# EAGLE design base-2u-mains-filter (EAGLE 5.06)
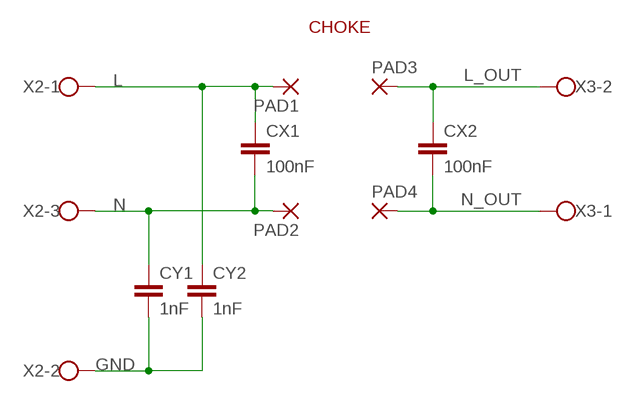
[diagram p0: schematic, sheet 1]

## Parts
CX1  100nF  CXXC15B6  [XC15B6]
CX2  100nF  CXXC15B6  [XC15B6]
CY1  1nF  CYYC10B5  [YC10B5]
CY2  1nF  CYYC10B5  [YC10B5]
PAD1  3,17/1,1  [3,17/1,1]
PAD2  3,17/1,1  [3,17/1,1]
PAD3  3,17/1,1  [3,17/1,1]
PAD4  3,17/1,1  [3,17/1,1]
X2  W237-03P  [W237-133]
X3  W237-02P  [W237-132]

## Nets
GND: CY1.2 CY2.2 X2.2
L: CX1.1 CY2.1 PAD1.1(P) X2.1
L_OUT: CX2.1 PAD3.1(P) X3.2
N: CX1.2 CY1.1 PAD2.1(P) X2.3
N_OUT: CX2.2 PAD4.1(P) X3.1

## Notes on the sheet
- CHOKE

## Library data of the parts
CX1 CX2 = rcl:CX: X CAPACITOR for power line
CY1 CY2 = rcl:CY: Y CAPACITOR for power line
PAD1-PAD4 = wirepad:3,17/1,1: THROUGH-HOLE PAD
X2 = con-wago-508:W237-03P: WAGO SREW CLAMP
X3 = con-wago-508:W237-02P: WAGO SREW CLAMP

## Board
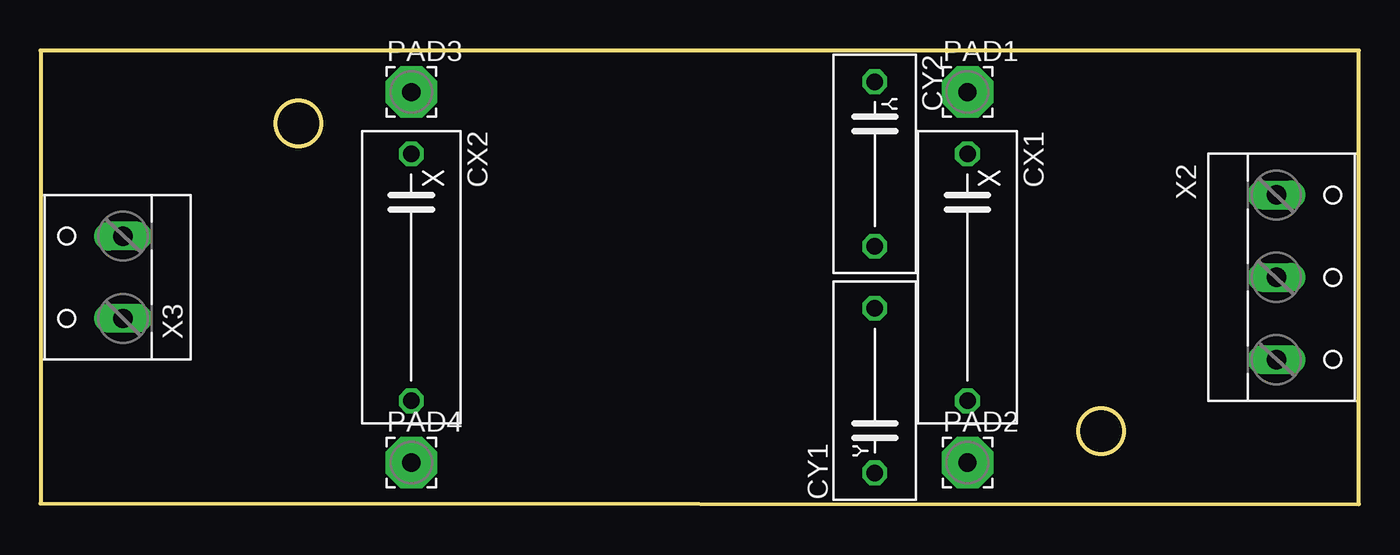
[diagram p1: board, top side]
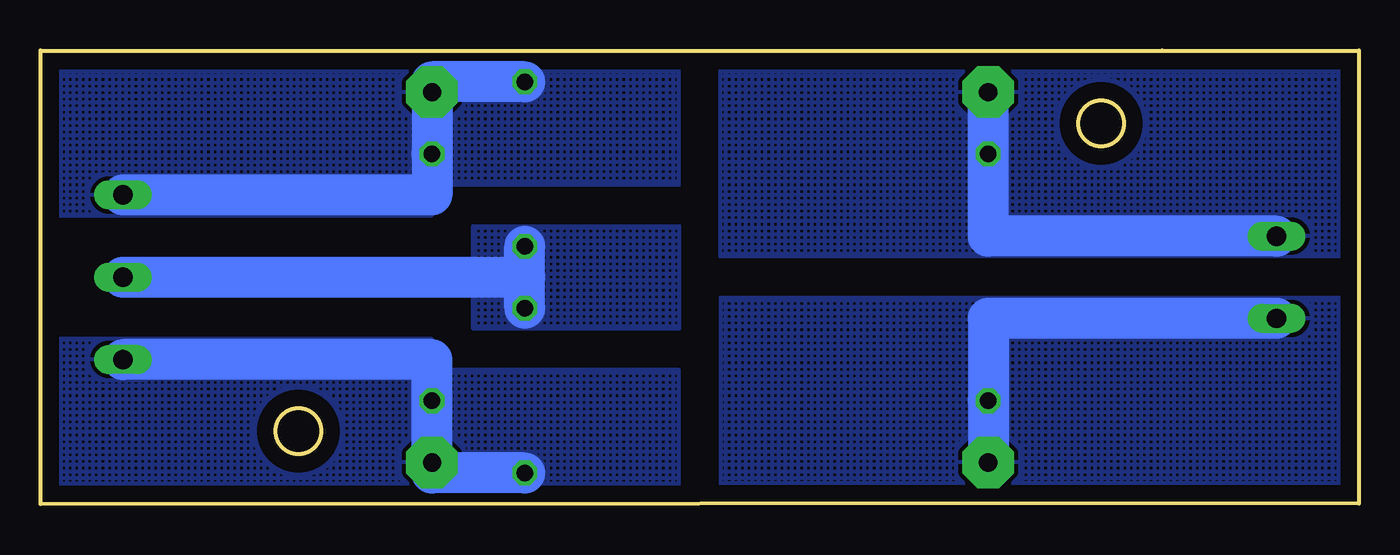
[diagram p2: board, bottom side, seen from below]

Size 81.28 x 27.98 mm. Coordinates in mm from the lower left corner, seen from the top.
Outline: 81.28,27.98 12.14,27.98 0,27.98 0,0.04 81.28,0 81.28,27.98
Outline: circle at 15.89,23.49 radius 1.4
Outline: circle at 65.39,4.49 radius 1.4
Copper layers (1*16): Top 0.035mm / dielectric 1.5mm / Bottom 0.035mm
Design rules "default": minimum track width 10mil, minimum drill 24mil, track to track 8mil, track to pad 8mil, pad to pad 8mil, via to via 8mil, smd to smd 8mil, copper to edge 40mil, drill to drill 8mil, minimum pad ring 10mil, minimum via ring 8mil, stop-mask expansion 4mil, vias tented up to drill 0mil, thermal gap 10mil

### Footprints (pad centres in the part's own frame; a part is rotated, then mirrored left to right if it is on the bottom)
XC15B6 = drill 1.016 octagon: 1 -7.62,0; 2 7.62,0
YC10B5 = drill 1.016 octagon: 1 -5.08,0; 2 5.08,0
3,17/1,1 = drill 1.118 pad 3.175 octagon: 1 0,0
W237-133 = drill 1.194 long: 1 -5.08,-0.635; 2 0,-0.635; 3 5.08,-0.635
W237-132 = drill 1.194 long: 1 -2.54,-0.635; 2 2.54,-0.635

### Placement (x,y rotation side)
CX1  57.15,13.99 270 top
CX2  22.86,13.99 270 top
CY1  51.44,7.01 90 top
CY2  51.44,20.98 270 top
PAD1  57.15,25.42 0 top
PAD2  57.15,2.56 0 top
PAD3  22.86,25.42 0 top
PAD4  22.86,2.56 0 top
X2  76.83,13.99 270 top
X3  4.45,13.99 90 top

### Tracks (layer width: path | path; a pad name or v marks a point on that pad's centre or on a via)
GND
  Bottom 2.54: 51.44,13.99 X2.2 | 51.44,13.99 CY2.2 | CY1.2 51.44,13.99
  pour Bottom (hatched): 54.61,17.16 41.91,17.16 41.91,10.81 54.61,10.81
L
  Bottom 2.54: X2.1 57.15,19.07 CX1.1 PAD1.1 57.15,26.05 CY2.1
  pour Bottom (hatched): 41.91,19.7 41.91,27.96 81.28,27.96 81.28,17.8 57.15,17.8 57.15,19.7
L_OUT
  Bottom 2.54: X3.2 22.86,16.53 CX2.1 PAD3.1
  pour Bottom (hatched): 0,15.26 39.37,15.26 39.37,27.96 0,27.96
N
  Bottom 2.54: CY1.1 57.15,1.92 PAD2.1 CX1.2 57.15,8.91 X2.3
  pour Bottom (hatched): 41.91,8.28 57.15,8.28 57.15,10.18 81.28,10.18 81.28,0.02 41.91,0.02
N_OUT
  Bottom 2.54: X3.1 22.86,11.45 CX2.2 PAD4.1
  pour Bottom (hatched): 0,12.72 39.37,12.72 39.37,0.02 0,0.02